# EAGLE design cap_touch_input (EAGLE 5.06)
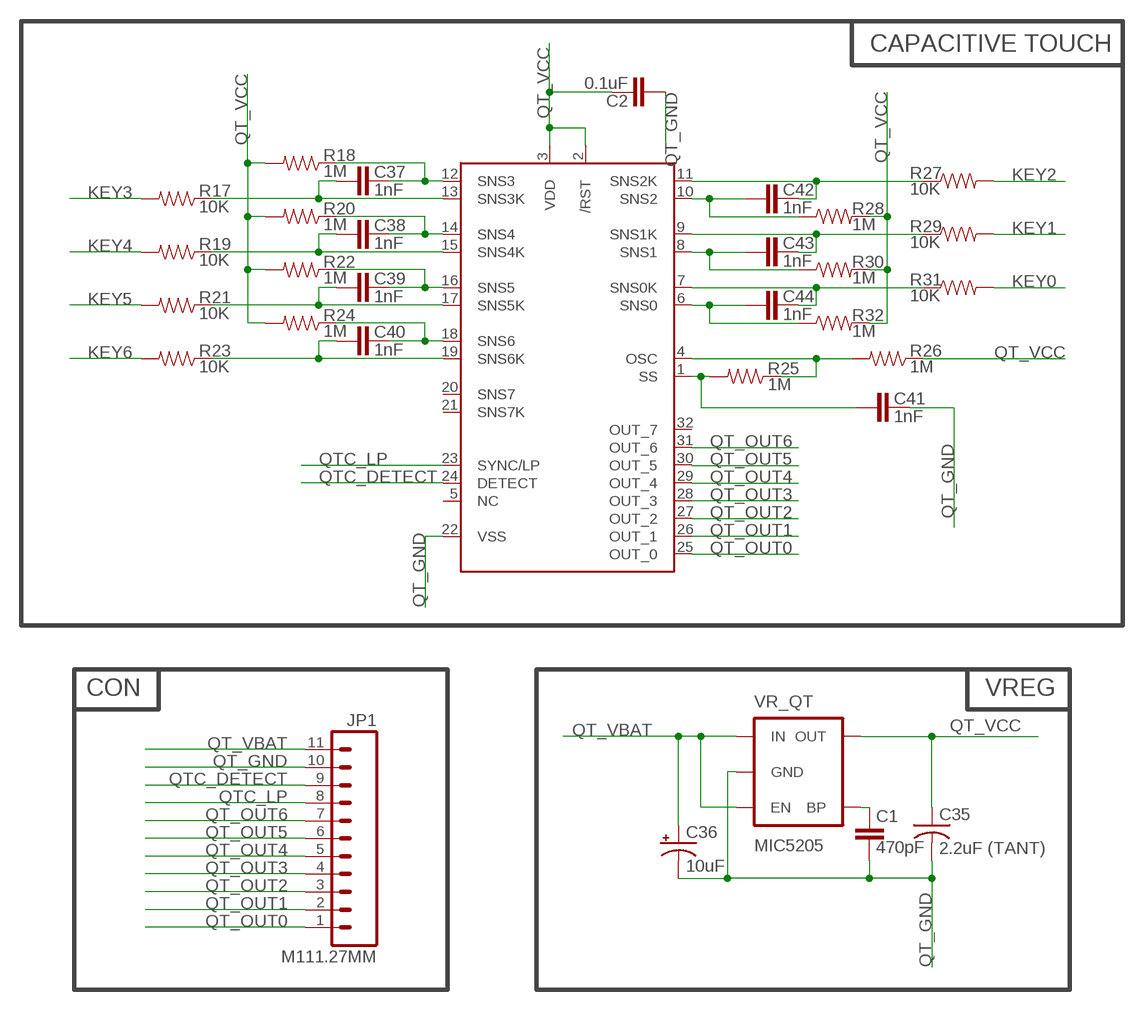
[diagram p0: schematic, sheet 1]

## Parts
C1  470pF  CAP0402  [C0402]
C2  0.1uF  CAP0402  [C0402]
C35  2.2uF (TANT)  C-USC0603K  [C0603K]
C36  10uF  CAP_POL1206  [EIA3216]
C37  1nF  CAP0402  [C0402]
C38  1nF  CAP0402  [C0402]
C39  1nF  CAP0402  [C0402]
C40  1nF  CAP0402  [C0402]
C41  1nF  CAP0402  [C0402]
C42  1nF  CAP0402  [C0402]
C43  1nF  CAP0402  [C0402]
C44  1nF  CAP0402  [C0402]
IC1  QT1081  [QFN-32]
JP1  M111.27MM  [1X11-1.27MM]
R17  10K  RESISTOR0402  [C0402]
R18  1M  RESISTOR0402  [C0402]
R19  10K  RESISTOR0402  [C0402]
R20  1M  RESISTOR0402  [C0402]
R21  10K  RESISTOR0402  [C0402]
R22  1M  RESISTOR0402  [C0402]
R23  10K  RESISTOR0402  [C0402]
R24  1M  RESISTOR0402  [C0402]
R25  1M  RESISTOR0402  [C0402]
R26  1M  RESISTOR0402  [C0402]
R27  10K  RESISTOR0402  [C0402]
R28  1M  RESISTOR0402  [C0402]
R29  10K  RESISTOR0402  [C0402]
R30  1M  RESISTOR0402  [C0402]
R31  10K  RESISTOR0402  [C0402]
R32  1M  RESISTOR0402  [C0402]
VR_QT  MIC5205  V_REG_LDOSMD  [SOT23-5]

## Nets
KEY0: R31.2
KEY1: R29.2
KEY2: R27.2
KEY3: R17.2
KEY4: R19.2
KEY5: R21.2
KEY6: R23.2
OSC: IC1.4(OSC) R25.1 R26.2
QT_GND: C1.1 C2.2 C35.2 C36.C(-) C41.1 IC1.22(VSS) JP1.10 VR_QT.2(GND)
QT_OUT0: IC1.25(OUT_0) JP1.1
QT_OUT1: IC1.26(OUT_1) JP1.2
QT_OUT2: IC1.27(OUT_2) JP1.3
QT_OUT3: IC1.28(OUT_3) JP1.4
QT_OUT4: IC1.29(OUT_4) JP1.5
QT_OUT5: IC1.30(OUT_5) JP1.6
QT_OUT6: IC1.31(OUT_6) JP1.7
QT_VBAT: C36.A(+) JP1.11 VR_QT.1(IN) VR_QT.3(EN)
QT_VCC: C2.1 C35.1 IC1.2(/RST) IC1.3(VDD) R18.2 R20.2 R22.2 R24.2 R26.1 R28.2 R30.2 R32.2 VR_QT.5(OUT)
QTC_DETECT: IC1.24(DETECT) JP1.9
QTC_LP: IC1.23(SYNC/LP) JP1.8
SNS0: C44.2 IC1.6(SNS0) R32.1
SNS0K: C44.1 IC1.7(SNS0K) R31.1
SNS1: C43.2 IC1.8(SNS1) R30.1
SNS1K: C43.1 IC1.9(SNS1K) R29.1
SNS2: C42.2 IC1.10(SNS2) R28.1
SNS2K: C42.1 IC1.11(SNS2K) R27.1
SNS3: C37.2 IC1.12(SNS3) R18.1
SNS3K: C37.1 IC1.13(SNS3K) R17.1
SNS4: C38.2 IC1.14(SNS4) R20.1
SNS4K: C38.1 IC1.15(SNS4K) R19.1
SNS5: C39.2 IC1.16(SNS5) R22.1
SNS5K: C39.1 IC1.17(SNS5K) R21.1
SNS6: C40.2 IC1.18(SNS6) R24.1
SNS6K: C40.1 IC1.19(SNS6K) R23.1
SS: C41.2 IC1.1(SS) R25.2
VRQT_BP: C1.2 VR_QT.4(BP)
Unconnected: IC1.5(NC) IC1.20(SNS7) IC1.21(SNS7K) IC1.32(OUT_7)

## Notes on the sheet
- CAPACITIVE TOUCH
- CON | VREG

## Library data of the parts
C1 C2 C37-C44 = SparkFun:CAP: Capacitor Standard 0603 ceramic capacitor, and 0.1" leaded capacitor.
C35 = rcl:C-US: CAPACITOR, American symbol
C36 = SparkFun-3-2-07:CAP_POL: Capacitor Polarized These are standard SMD and PTH capacitors. Normally 10uF, 47uF, and 100uF in electrolytic and tantalum varieties. Always verify the external diameter of the through hole cap, it varies with capacity, voltage, and manufacturer. The EIA devices should be standard.
IC1 = qtouch:QT1081: The QTouch QT1081 chip from Atmel - Formerly from Quantum Research Group - Pretty simple: You connect properly sized copper pads to the pins as shown in the datasheet, and you get eight logic level outputs. - Digikey: 427-1127-1-ND
JP1 = SparkFun:M11: Header 11 Standard 11-pin 0.1" header. Use with straight break away headers (SKU : PRT-00116), right angle break away headers (PRT-00553), swiss pins (PRT-00743), machine pins (PRT-00117), and female headers (PRT-00115).
R17-R32 = SparkFun:RESISTOR: Resistor Basic schematic elements and footprints for 0603, 1206, and PTH 1/10th watt (small) resistors.
VR_QT = SparkFun-3-2-07:V_REG_LDO: Voltage Regulator LDO Standard 150mA LDO voltage regulator in SOT-23 layout. Micrel part MIC5205. BP (by-pass) pin is used to lower output noise with 470pF cap.

## Board
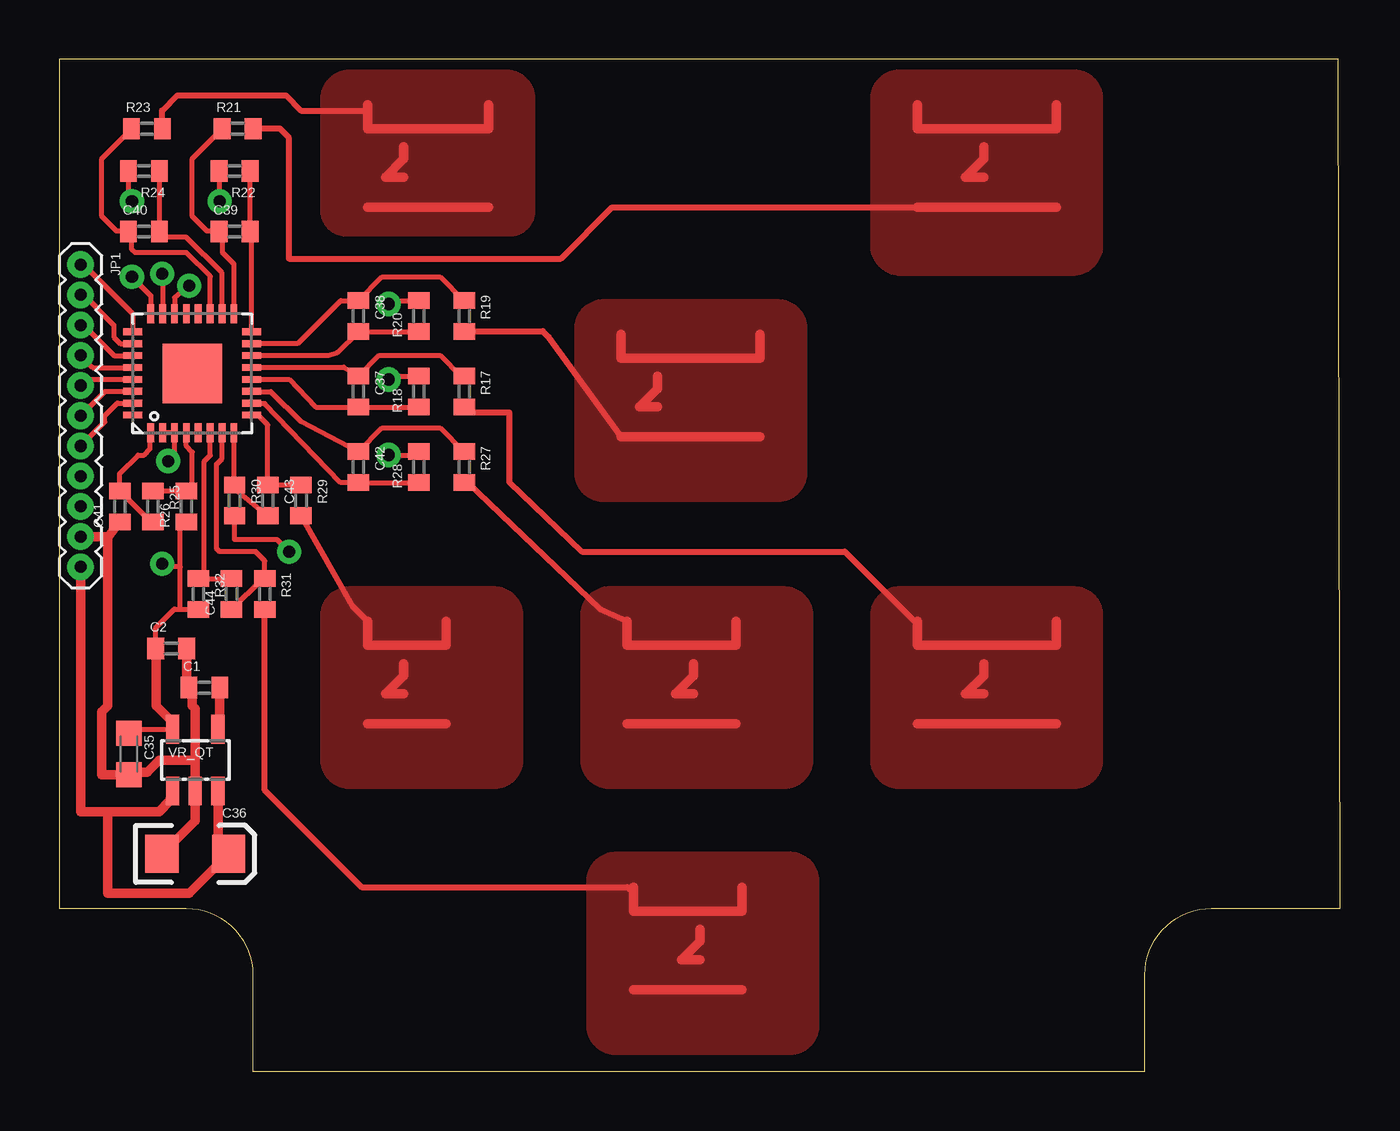
[diagram p1: board, top side]
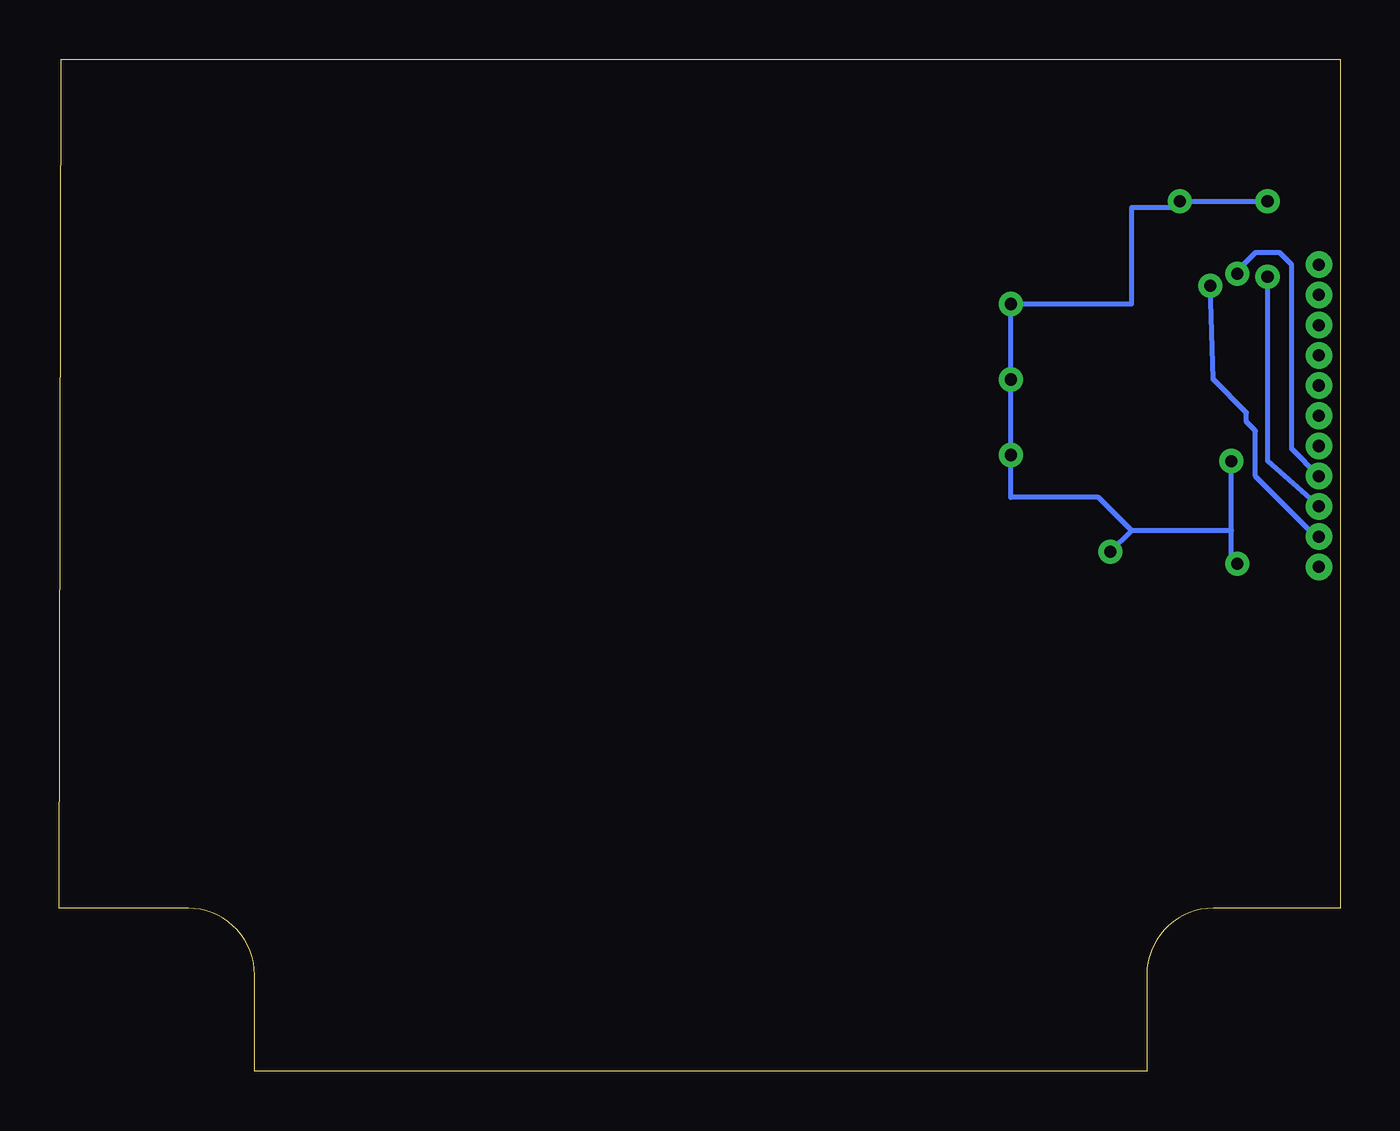
[diagram p2: board, bottom side, seen from below]

Size 53.85 x 42.54 mm. Coordinates in mm from the lower left corner, seen from the top.
Outline: 8.13,0 45.64,0 45.64,4.06 arc-90 48.44,6.86 53.85,6.86 53.77,42.54 0,42.54 0,6.86 5.33,6.86 arc-90 8.13,4.06 8.13,0
Copper layers (1*16): Top 0.035mm / dielectric 1.5mm / Bottom 0.035mm
Design rules "ZephyrEye": minimum track width 8mil, minimum drill 20mil, track to track 8mil, track to pad 8mil, pad to pad 8mil, via to via 8mil, smd to smd 8mil, copper to edge 10mil, drill to drill 8mil, minimum pad ring 12mil, minimum via ring 10mil, stop-mask expansion 4mil, vias tented up to drill 25mil, thermal gap 10mil

### Footprints (pad centres in the part's own frame; a part is rotated, then mirrored left to right if it is on the bottom)
C0402 = smd 0.7 x 0.9: 1 -0.65,0; 2 0.65,0
C0603K = smd 1.05 x 1.08: 1 -0.875,0; 2 0.875,0
EIA3216 = smd 1.4 x 1.6: A 1.4,0; C -1.4,0
QFN-32 = smd 0.285 x 0.8: 1 -1.75,-2.5; 2 -1.25,-2.5; 3 -0.75,-2.5; 4 -0.25,-2.5; 5 0.25,-2.5; 6 0.75,-2.5; 7 1.25,-2.5; 8 1.75,-2.5; 17 1.75,2.5; 18 1.25,2.5; 19 0.75,2.5; 20 0.25,2.5; 21 -0.25,2.5; 22 -0.75,2.5; 23 -1.25,2.5; 24 -1.75,2.5 | smd 0.8 x 0.285: 9 2.5,-1.75; 10 2.5,-1.25; 11 2.5,-0.75; 12 2.5,-0.25; 13 2.5,0.25; 14 2.5,0.75; 15 2.5,1.25; 16 2.5,1.75; 25 -2.5,1.75; 26 -2.5,1.25; 27 -2.5,0.75; 28 -2.5,0.25; 29 -2.5,-0.25; 30 -2.5,-0.75; 31 -2.5,-1.25; 32 -2.5,-1.75 | smd 2.5 x 2.5: BACKPLANE 0,0
1X11-1.27MM = drill 0.508 pad 1 round: 1 0,0; 2 1.27,0; 3 2.54,0; 4 3.81,0; 5 5.08,0; 6 6.35,0; 7 7.62,0; 8 8.89,0; 9 10.16,0; 10 11.43,0; 11 12.7,0
SOT23-5 = smd 0.55 x 1.2: 1 -0.95,-1.3; 2 0,-1.3; 3 0.95,-1.3; 4 0.95,1.3; 5 -0.95,1.3

### Placement (x,y rotation side)
C1  6.1,16.13 0 top
C2  4.7,17.78 0 top
C35  2.92,13.34 270 top
C36  5.71,9.14 0 top
C37  12.57,28.57 270 top
C38  12.57,31.75 270 top
C39  7.37,35.31 0 top
C40  3.56,35.31 0 top
C41  2.54,23.75 90 top
C42  12.57,25.4 270 top
C43  8.76,24 270 top
C44  7.24,20.07 90 top
IC1  5.59,29.34 0 top
JP1  0.89,33.91 270 top
R17  17.02,28.57 270 top
R18  15.11,28.57 90 top
R19  17.02,31.75 270 top
R20  15.11,31.75 90 top
R21  7.49,39.62 0 top
R22  7.37,37.85 180 top
R23  3.68,39.62 0 top
R24  3.56,37.85 180 top
R25  3.94,23.75 270 top
R26  5.33,23.75 90 top
R27  17.02,25.4 270 top
R28  15.11,25.4 90 top
R29  10.16,24 270 top
R30  7.37,24 270 top
R31  8.64,20.07 270 top
R32  5.84,20.07 270 top
VR_QT  5.71,13.08 0 top

### Tracks (layer width: path | path; a pad name or v marks a point on that pad's centre or on a via)
KEY0
  Top 0.254: R31.2 8.64,11.81 12.7,7.75 23.88,7.75 24.13,7.49
  Top 0.406: 26.92,5.97 26.92,5.46 26.16,4.7 26.92,4.7 | 24.13,7.75 24.13,7.49 24.13,6.73 28.7,6.73 28.7,7.75 | 24.13,3.43 28.7,3.43
  pour Top: 23.37,9.03 arc90 22.35,8 22.35,1.91 arc90 23.37,0.89 30.73,0.89 arc90 31.75,1.91 31.75,8 arc90 30.73,9.03
KEY1
  Top 0.254: R29.2 12.33,19.54 12.95,18.92
  Top 0.406: 12.95,14.61 16.26,14.61 | 14.48,17.14 14.48,16.64 13.72,15.88 14.48,15.88 | 12.95,18.92 12.95,17.91 16.26,17.91 16.26,18.92
  pour Top: 12.19,20.19 arc90 11.18,19.18 11.18,13.08 arc90 12.19,12.06 18.29,12.06 arc90 19.3,13.08 19.3,19.18 arc90 18.29,20.19
KEY2
  Top 0.254: 23.88,18.92 22.73,19.43 17.14,24.76 17.03,24.76
  Top 0.305: R27.2 17.03,24.76
  Top 0.406: 26.67,17.14 26.67,16.64 25.91,15.88 26.67,15.88 | 23.88,18.92 23.88,17.91 28.45,17.91 28.45,18.92 | 23.88,14.61 28.45,14.61
  pour Top: 23.11,20.19 arc90 22.1,19.18 22.1,13.08 arc90 23.11,12.06 30.48,12.06 arc90 31.5,13.08 31.5,19.18 arc90 30.48,20.19
KEY3
  Top 0.254: 36.07,18.92 35.94,18.92 33.02,21.84 21.97,21.84 18.92,24.76 18.92,27.69 17.4,27.69 17.16,27.94
  Top 0.305: 17.16,27.94 R17.2
  Top 0.406: 36.07,14.61 41.91,14.61 | 38.86,17.14 38.86,16.64 38.1,15.88 38.86,15.88 | 36.07,18.92 36.07,17.91 41.91,17.91 41.91,18.92
  pour Top: 35.31,20.19 arc90 34.29,19.18 34.29,13.08 arc90 35.31,12.06 42.67,12.06 arc90 43.69,13.08 43.69,19.18 arc90 42.67,20.19
KEY4
  Top 0.254: 23.62,26.67 20.57,30.86 20.32,31.11 17.03,31.11
  Top 0.305: R19.2 17.03,31.11
  Top 0.406: 25.15,29.21 25.15,28.7 24.38,27.94 25.15,27.94 | 23.62,30.99 23.62,29.97 29.46,29.97 29.46,30.99 | 23.62,26.67 29.46,26.67
  pour Top: 22.86,32.26 arc90 21.84,31.24 21.84,25.15 arc90 22.86,24.13 30.23,24.13 arc90 31.24,25.15 31.24,31.24 arc90 30.23,32.26
KEY5
  Top 0.254: R21.2 9.27,39.62 9.65,39.24 9.65,34.16 21.08,34.16 23.24,36.32 36.07,36.32
  Top 0.406: 36.07,36.32 41.91,36.32 | 38.86,38.86 38.86,38.35 38.1,37.59 38.86,37.59 | 36.07,40.64 36.07,39.62 41.91,39.62 41.91,40.64
  pour Top: 35.31,41.91 arc90 34.29,40.89 34.29,34.8 arc90 35.31,33.64 42.67,33.64 arc90 43.69,34.8 43.69,40.89 arc90 42.67,41.91
KEY6
  Top 0.254: 4.32,39.64 4.32,40.39 4.95,41.02 9.53,41.02 10.16,40.39 12.95,40.39
  Top 0.305: R23.2 4.32,39.64
  Top 0.406: 12.95,36.32 18.03,36.32 | 14.48,38.86 14.48,38.35 13.72,37.59 14.48,37.59 | 12.95,40.64 12.95,40.39 12.95,39.62 18.03,39.62 18.03,40.64
  pour Top: 12.19,41.91 arc90 11.18,40.89 11.18,36.07 arc90 12.19,35.29 18.8,35.29 arc90 19.81,36.07 19.81,40.89 arc90 18.8,41.91
OSC
  Top 0.203: R25.1 R26.2 5.59,24.65 5.59,26.04 5.33,26.29 IC1.4
QT_GND  (via drill 0.51)
  Top 0.203: IC1.22 4.84,32.52 v5.46,33.02
  Top 0.406: C36.C 5.71,10.54 VR_QT.2 5.71,13.08 | C35.2 3.17,12.46 | 5.71,13.08 4.19,13.08 3.68,12.57 3.03,12.57 C35.2 | 5.71,13.08 5.71,15.24 5.59,15.37 5.59,15.99 C1.1 5.35,16.23 C2.2 | 2.03,22.48 JP1.10 | 2.03,22.48 2.03,15.37 1.78,15.11 1.78,12.46 C35.2 | 2.03,22.48 2.05,22.48 C41.1
  Bottom 0.203: v5.46,33.02 5.33,29.08 3.94,27.69 3.94,27.3 3.56,26.92 3.56,25.02 1.02,22.48 JP1.10
QT_OUT0
  Top 0.203: IC1.25 3.09,31.84 1.27,33.66 JP1.1
QT_OUT1
  Top 0.203: IC1.26 2.56,30.59 2.29,30.86 2.29,31.37 1.02,32.64 JP1.2
QT_OUT2
  Top 0.203: IC1.27 2.3,30.09 1.02,31.37 JP1.3
QT_OUT3
  Top 0.203: IC1.28 1.4,29.59 JP1.4
QT_OUT4
  Top 0.203: IC1.29 1.15,29.09 JP1.5
QT_OUT5
  Top 0.203: IC1.30 1.92,28.59 JP1.6
QT_OUT6
  Top 0.203: IC1.31 2.43,28.09 1.91,27.56 1.91,27.3 JP1.7
QT_VBAT
  Top 0.406: VR_QT.3 6.67,9.59 C36.A 5.46,7.49 2.03,7.49 2.03,10.92 | VR_QT.1 4.64,11.37 4.19,10.92 2.03,10.92 | JP1.11 0.89,10.92 2.03,10.92
QT_VCC  (via drill 0.51)
  Top 0.203: VR_QT.5 3.35,14.38 C35.1 | C2.1 4.05,18.65 4.83,19.43 5.08,19.43 | 5.08,19.43 5.83,19.43 R32.2 | R26.1 5.08,22.84 5.08,21.21 | 5.08,19.43 5.08,21.21 | IC1.2 IC1.3 4.84,25.92 v4.57,25.65 | v4.32,21.34 4.45,21.21 5.08,21.21 | R30.2 7.37,22.35 9.14,22.35 v9.65,21.84 | R28.2 14.97,25.91 v13.84,25.91 | R18.2 13.98,29.22 v13.84,29.08 | R20.2 13.98,32.4 v13.84,32.26 | v6.73,36.58 6.73,37.83 R22.2 | R24.2 2.91,36.72 v3.05,36.58
  Top 0.406: VR_QT.5 4.76,14.67 4.06,15.37 4.06,17.76 C2.1
  Bottom 0.203: 4.57,22.73 4.57,21.59 v4.32,21.34 | 4.57,22.73 v4.57,25.65 | 8.76,22.73 v9.65,21.84 | 4.57,22.73 8.76,22.73 | 8.76,22.73 10.16,24.13 13.84,24.13 v13.84,25.91 v13.84,29.08 v13.84,32.26 8.76,32.26 8.76,36.32 6.99,36.32 v6.73,36.58 v3.05,36.58
QTC_DETECT  (via drill 0.51)
  Top 0.203: IC1.24 3.84,32.61 v3.05,33.4
  Bottom 0.203: v3.05,33.4 3.05,25.65 JP1.9
QTC_LP  (via drill 0.51)
  Top 0.203: IC1.23 4.34,33.38 v4.32,33.53
  Bottom 0.203: v4.32,33.53 4.32,33.66 3.56,34.42 2.54,34.42 2.03,33.91 2.03,26.16 JP1.8
SNS0
  Top 0.203: C44.2 R32.1 6.1,20.97 6.1,25.65 6.34,25.9 IC1.6
SNS0K
  Top 0.203: IC1.7 6.84,25.76 6.6,25.53 6.6,21.97 6.73,21.84 8.26,21.84 8.64,21.46 R31.1 8.54,20.72 C44.1
SNS1
  Top 0.203: C43.2 7.46,24.4 R30.1 7.34,24.43 IC1.8
SNS1K
  Top 0.203: R29.1 C43.1 8.76,27.18 8.35,27.59 IC1.9
SNS2
  Top 0.203: IC1.10 8.11,28.07 8.64,28.07 11.83,24.75 C42.2 R28.1
SNS2K
  Top 0.203: R27.1 17,26.05 16,27.05 13.57,27.05 C42.1 10.14,27.32 8.89,28.57 IC1.11
SNS3
  Top 0.203: IC1.12 9.65,29.08 10.78,27.92 C37.2 R18.1
SNS3K
  Top 0.203: R17.1 16.88,29.22 16,30.1 13.45,30.1 C37.1 11.95,29.61 9.4,29.59 IC1.13
SNS4
  Top 0.203: R20.1 C38.2 11.67,30.21 11.3,30.1 8.1,30.1 IC1.14
SNS4K
  Top 0.203: R19.1 17,32.4 16,33.4 13.57,33.4 C38.1 11.83,32.4 10.03,30.61 8.11,30.61 IC1.15
SNS5
  Top 0.203: IC1.16 8.09,35.23 C39.2 R22.1
SNS5K
  Top 0.203: IC1.17 7.34,33.94 6.86,34.42 6.86,35.16 C39.1 6.21,35.32 5.59,35.94 5.59,38.37 R21.1
SNS6
  Top 0.203: IC1.18 6.84,33.56 5.33,35.05 4.46,35.05 C40.2 R24.1
SNS6K
  Top 0.203: IC1.19 6.34,33.41 5.33,34.42 3.17,34.42 3.05,34.54 3.05,35.16 C40.1 2.4,35.32 1.78,35.94 1.78,38.37 R23.1
SS
  Top 0.203: R25.2 3.84,23.1 C41.2 2.54,25.15 3.3,25.91 3.56,25.91 3.81,26.16 3.81,26.81 IC1.1
VRQT_BP
  Top 0.406: C1.2 6.75,14.46 VR_QT.4